# Altium schematic sheet W2_NRF.SchDoc
size A4
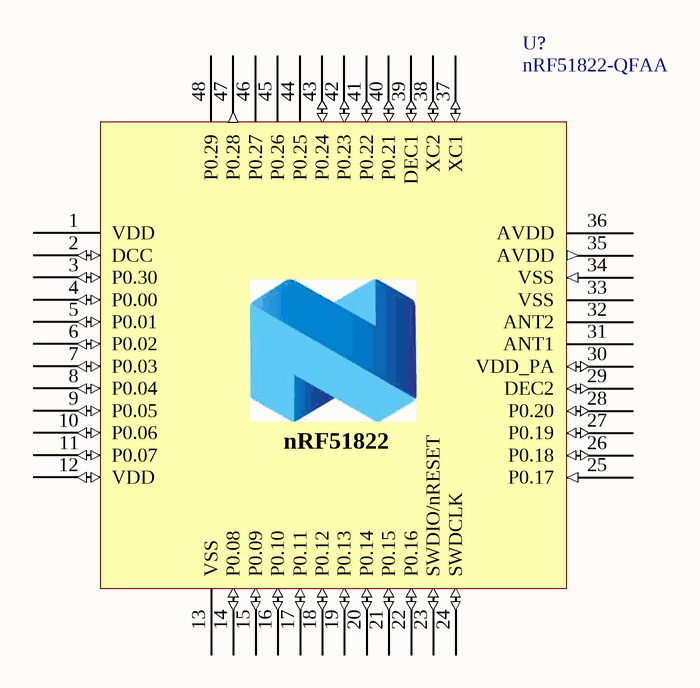
[diagram p0: W2_NRF.SchDoc]

## Parts
U?  nRF51822-QFAA  [QFN48 6X6]

## Nets
GND: U?.0(GND)

Not connected (* = marked no-connect by the designer): U? 1(VDD) 2(DCC) 3(P0.30) 4(P0.00) 5(P0.01) 6(P0.02) 7(P0.03) 8(P0.04) 9(P0.05) 10(P0.06) 11(P0.07) 12(VDD) 13(VSS) 14(P0.08) 15(P0.09) 16(P0.10) 17(P0.11) 18(P0.12) 19(P0.13) 20(P0.14) 21(P0.15) 22(P0.16) 23(SWDIO/nRESET) 24(SWDCLK) 25(P0.17) 26(P0.18) 27(P0.19) 28(P0.20) 29(DEC2) 30(VDD_PA) 31(ANT1) 32(ANT2) 33(VSS) 34(VSS) 35(AVDD) 36(AVDD) 37(XC1) 38(XC2) 39(DEC1) 40(P0.21) 41(P0.22) 42(P0.23) 43(P0.24) 44(P0.25) 45(P0.26) 46(P0.27) 47(P0.28) 48(P0.29)

## Notes on the sheet
- (in symbol nRF51822-QFAA) nRF51822

## Library data of the parts
U? = nRF51822-QFAA: QFN48; _Comma: ,; _Name: MCU; _Specification: MCU,nRF51822-QFAA,QFN48; _Footprint: QFN48; _Model: nRF51822-QFAA